# Altium schematic sheet k26_baseboard_connectors1.SchDoc: k26 Baseboard Connectors 1
size A3; DrawnBy: Ch. Vogt; Engineer: Ch. Vogt; Organization: PBL; DocumentNumber: 1; Revision: r5; SheetNumber: 2
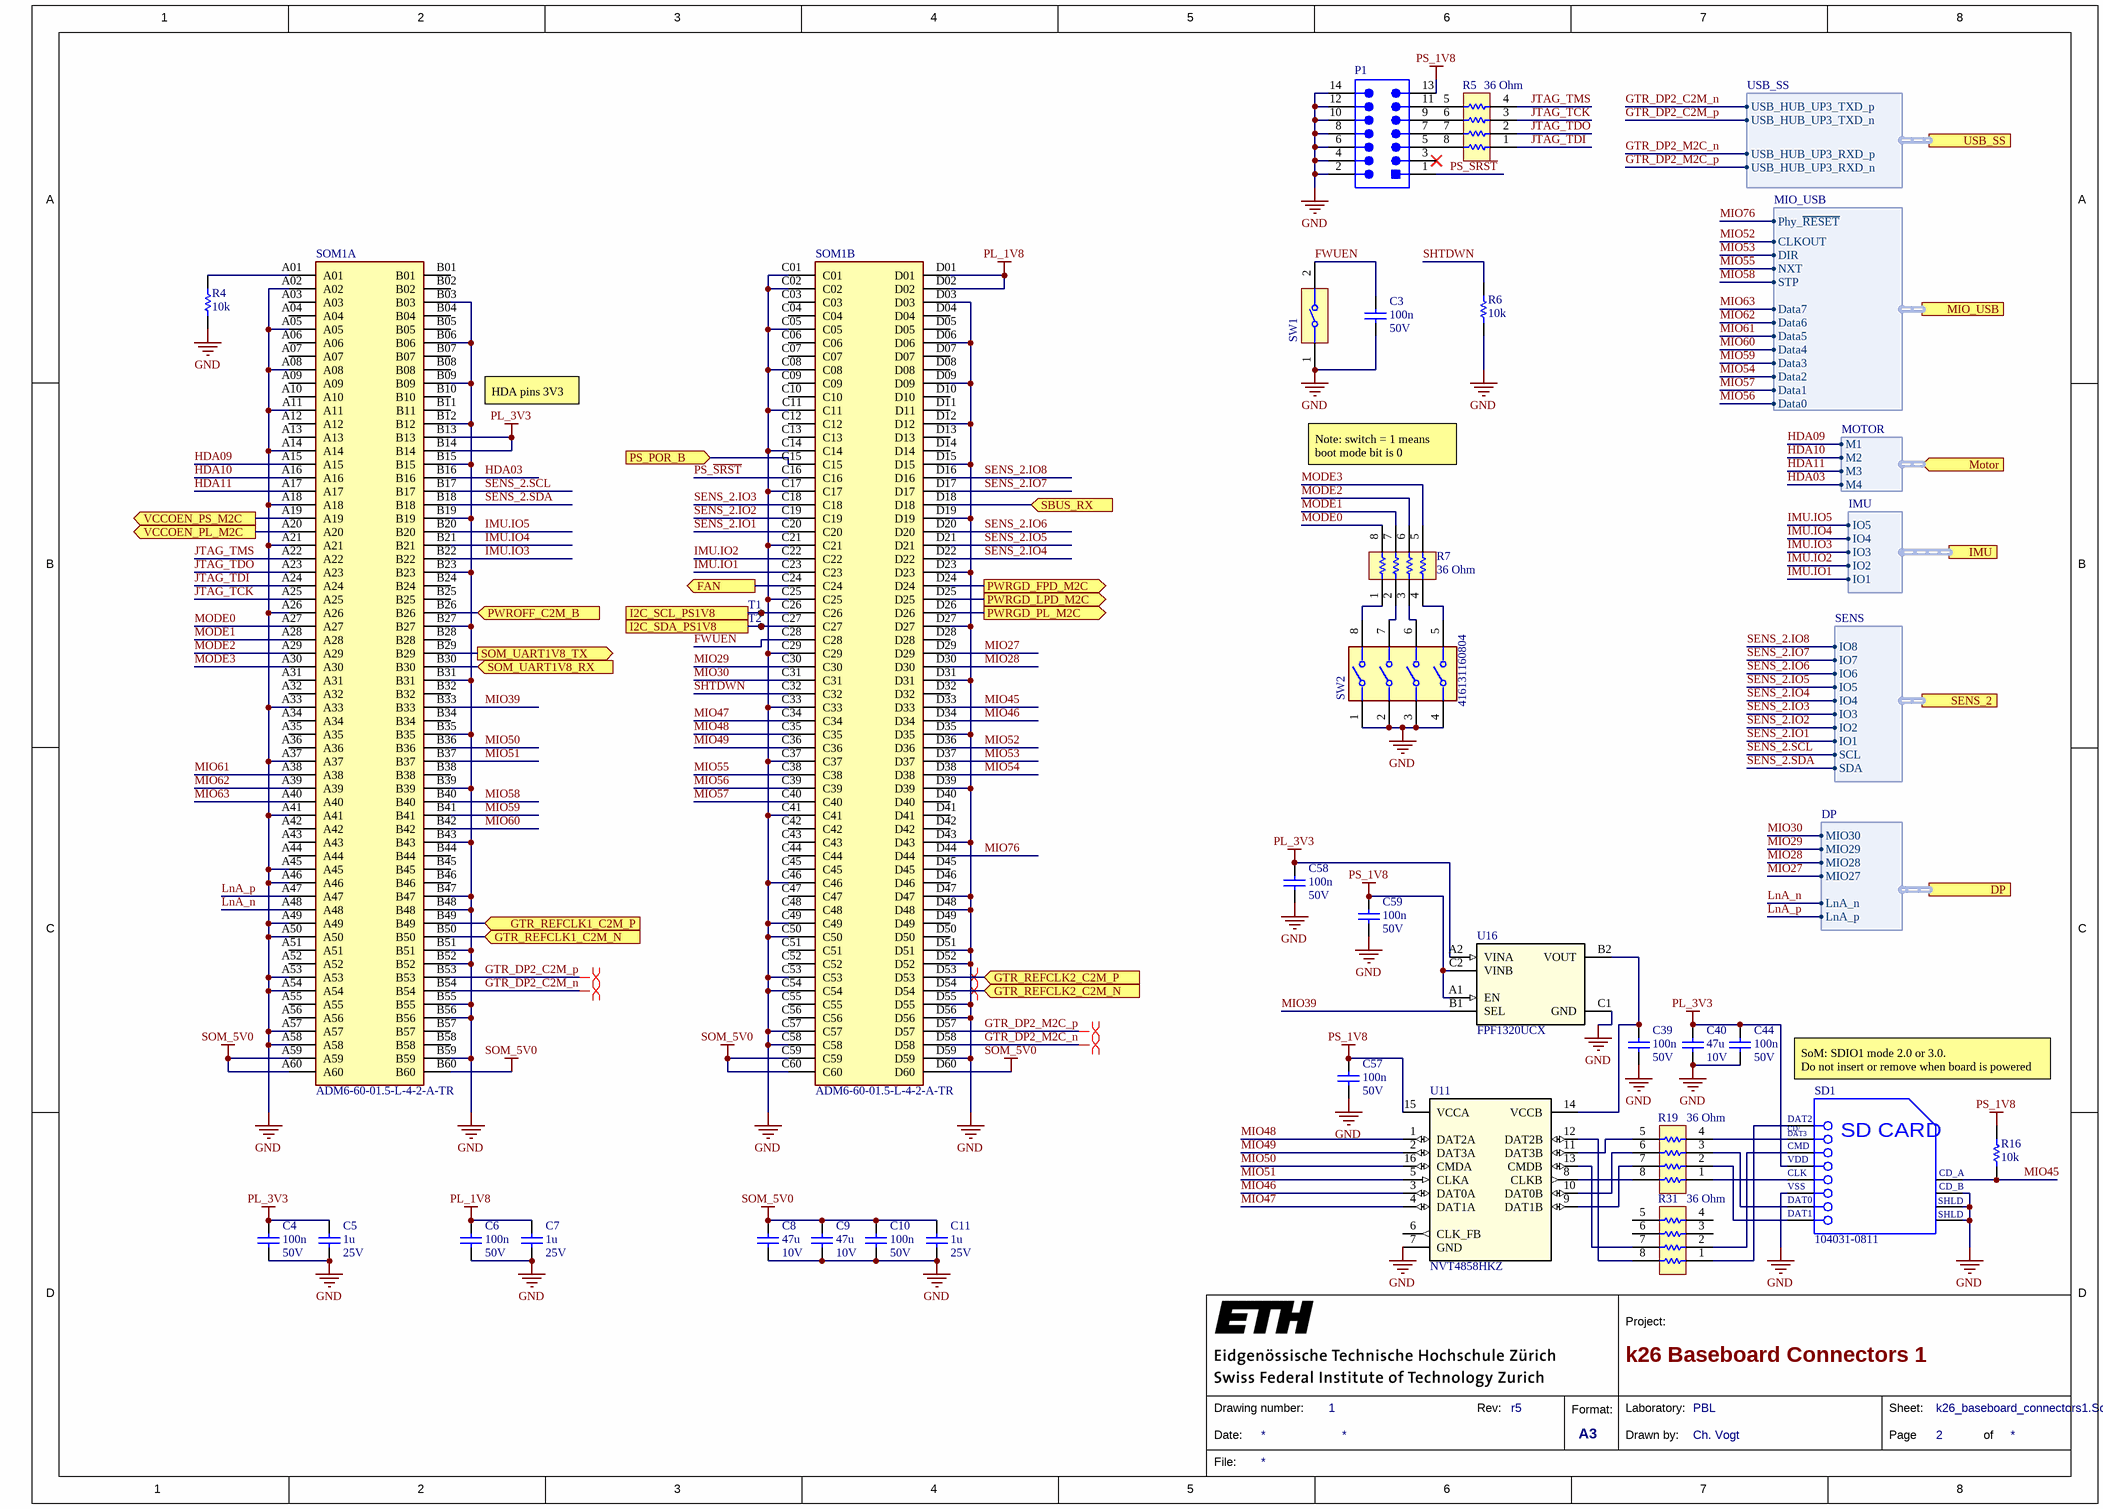
[diagram p0: k26_baseboard_connectors1.SchDoc]

## Parts
C3  100n  Rated DC Voltage (URdc): 50V  [CAPC0402]
C4  100n  Rated DC Voltage (URdc): 50V  [CAPC0402]
C5  1u  Rated DC Voltage (URdc): 25V  [CAPC0402]
C6  100n  Rated DC Voltage (URdc): 50V  [CAPC0402]
C7  1u  Rated DC Voltage (URdc): 25V  [CAPC0402]
C8  47u  Rated DC Voltage (URdc): 10V  [CAPC1206]
C9  47u  Rated DC Voltage (URdc): 10V  [CAPC1206]
C10  100n  Rated DC Voltage (URdc): 50V  [CAPC0402]
C11  1u  Rated DC Voltage (URdc): 25V  [CAPC0402]
C39  100n  Rated DC Voltage (URdc): 50V  [CAPC0402]
C40  47u  Rated DC Voltage (URdc): 10V  [CAPC1206]
C44  100n  Rated DC Voltage (URdc): 50V  [CAPC0402]
C57  100n  Rated DC Voltage (URdc): 50V  [CAPC0402]
C58  100n  Rated DC Voltage (URdc): 50V  [CAPC0402]
C59  100n  Rated DC Voltage (URdc): 50V  [CAPC0402]
P1  (no value)  [MOLX-87833-1420_V]
R4  10k  [RES0402]
R5  Resistance: 36 Ohm  [BOUR-CAY10-J4_V]  (hidden comment: CAY10-360J4LF)
R6  10k  [RES0402]
R7  Resistance: 36 Ohm  [BOUR-CAY10-J4_V]  (hidden comment: CAY10-360J4LF)
R16  10k  [RES0402]
R19  Resistance: 36 Ohm  [BOUR-CAY10-J4_V]  (hidden comment: CAY10-360J4LF)
R31  Resistance: 36 Ohm  [BOUR-CAY10-J4_V]  (hidden comment: CAY10-360J4LF)
SD1  104031-0811  [MOLX-104031-0811_V]
SOM1  ADM6-60-01.5-L-4-2-A-TR  [SAMTEC_ADM6-60-01.5-L-4-2-A-TR]  (parts A,B of 2)
SW1  KSS241GLFS  [KSS241GLFS]  (value not drawn)
SW2  416131160804  [FP-416131160804-MFG]
T1  (no value)  [Pad-1mm]  (no BOM)
T2  (no value)  [Pad-1mm]  (no BOM)
U11  NVT4858HKZ  [NVT4858_NXP]
U16  FPF1320UCX  [WLCSP6_1X1.5_ONS-M]

## Ports
DP (harness DP), FAN (out), GTR_REFCLK1_C2M_N (in), GTR_REFCLK1_C2M_P (in), GTR_REFCLK2_C2M_N (in), GTR_REFCLK2_C2M_P (in), I2C_SCL_PS1V8, I2C_SDA_PS1V8, IMU (harness IMU), MIO_USB (harness MIO_USB), Motor (in, harness MOTOR), PS_POR_B (in), PWRGD_FPD_M2C (out), PWRGD_LPD_M2C (out), PWRGD_PL_M2C (out), PWROFF_C2M_B (in), SBUS_RX (in), SENS_2 (harness SENS), SOM_UART1V8_RX (in), SOM_UART1V8_TX (out), USB_SS (harness USB_SS), VCCOEN_PL_M2C (out), VCCOEN_PS_M2C (out)

## Harnesses
MOTOR: M1, M2, M3, M4
MIO_USB: Data0, Data1, Data2, Data3, Data4, Data5, Data6, Data7, STP, NXT, DIR, CLKOUT, Phy_~{RESET}
DP: LnA_p, LnA_n, MIO27, MIO28, MIO29, MIO30
USB_SS: USB_HUB_UP3_RXD_n, USB_HUB_UP3_RXD_p, USB_HUB_UP3_TXD_n, USB_HUB_UP3_TXD_p
SENS: SCL, SDA, IO1, IO2, IO3, IO4, IO5, IO6, IO7, IO8
IMU: IO1, IO2, IO3, IO4, IO5

## Nets
GND: C3.1 C4.1 C5.1 C6.1 C7.1 C8.1 C9.1 C10.1 C11.1 C39.1 C40.1 C44.1 C57.1 C58.1 C59.1 P1.2 P1.4 P1.6 P1.8 P1.10 P1.12 P1.14 R4.1 R6.1 SD1.6(VSS2) SD1.10(CD_B) SD1.11(SHLD1) SD1.12(SHLD2) SOM1.A02 SOM1.A05 SOM1.A08 SOM1.A11 SOM1.A14 SOM1.A18 SOM1.A21 SOM1.A26 SOM1.A33 SOM1.A37 SOM1.A41 SOM1.A45 SOM1.A46 SOM1.A49 SOM1.A50 SOM1.A53 SOM1.A54 SOM1.A57 SOM1.A58 SOM1.B03 SOM1.B06 SOM1.B09 SOM1.B12 SOM1.B15 SOM1.B19 SOM1.B23 SOM1.B27 SOM1.B31 SOM1.B35 SOM1.B39 SOM1.B43 SOM1.B47 SOM1.B48 SOM1.B51 SOM1.B52 SOM1.B55 SOM1.B56 SOM1.B59 SOM1.C01 SOM1.C02 SOM1.C05 SOM1.C08 SOM1.C11 SOM1.C14 SOM1.C17 SOM1.C21 SOM1.C25 SOM1.C29 SOM1.C33 SOM1.C37 SOM1.C41 SOM1.C46 SOM1.C49 SOM1.C50 SOM1.C53 SOM1.C54 SOM1.C57 SOM1.C58 SOM1.D03 SOM1.D06 SOM1.D09 SOM1.D12 SOM1.D15 SOM1.D19 SOM1.D23 SOM1.D27 SOM1.D31 SOM1.D35 SOM1.D39 SOM1.D43 SOM1.D47 SOM1.D48 SOM1.D51 SOM1.D52 SOM1.D55 SOM1.D56 SOM1.D59 SW1.1(T1) SW2.1 SW2.2 SW2.3 SW2.4 U11.7(GND) U16.C1(GND)
PL_1V8: C6.2 C7.2 SOM1.D01 SOM1.D02
PL_3V3: C4.2 C5.2 C40.2 C44.2 C58.2 SD1.4(VDD) SOM1.B13 SOM1.B14 U16.A2(VINA)
PS_1V8: C57.2 C59.2 P1.13 R16.2 U11.15(VCCA) U16.A1(EN) U16.C2(VINB)
SOM_5V0: C8.2 C9.2 C10.2 C11.2 SOM1.A59 SOM1.A60 SOM1.B60 SOM1.C59 SOM1.C60 SOM1.D60
FAN: SOM1.C24 ; port FAN
FWUEN: C3.2 SOM1.C28 SW1.2(T2)
GTR_DP2_C2M_n: SOM1.B54 ; port USB_SS.USB_HUB_UP3_TXD_p
GTR_DP2_C2M_p: SOM1.B53 ; port USB_SS.USB_HUB_UP3_TXD_n
GTR_DP2_M2C_n: SOM1.D58 ; port USB_SS.USB_HUB_UP3_RXD_p
GTR_DP2_M2C_p: SOM1.D57 ; port USB_SS.USB_HUB_UP3_RXD_n
GTR_REFCLK1_C2M_N: SOM1.B50 ; port GTR_REFCLK1_C2M_N
GTR_REFCLK1_C2M_P: SOM1.B49 ; port GTR_REFCLK1_C2M_P
GTR_REFCLK2_C2M_N: SOM1.D54 ; port GTR_REFCLK2_C2M_N
GTR_REFCLK2_C2M_P: SOM1.D53 ; port GTR_REFCLK2_C2M_P
HDA03: SOM1.B16 ; port Motor.M4
HDA09: SOM1.A15 ; port Motor.M1
HDA10: SOM1.A16 ; port Motor.M2
HDA11: SOM1.A17 ; port Motor.M3
I2C_SCL_PS1V8: SOM1.C26 T1.1 ; port I2C_SCL_PS1V8
I2C_SDA_PS1V8: SOM1.C27 T2.1 ; port I2C_SDA_PS1V8
IMU.IO1: SOM1.C23 ; port IMU.IO1
IMU.IO2: SOM1.C22 ; port IMU.IO2
IMU.IO3: SOM1.B22 ; port IMU.IO3
IMU.IO4: SOM1.B21 ; port IMU.IO4
IMU.IO5: SOM1.B20 ; port IMU.IO5
JTAG_TCK: R5.3 SOM1.A25
JTAG_TDI: R5.1 SOM1.A24
JTAG_TDO: R5.2 SOM1.A23
JTAG_TMS: R5.4 SOM1.A22
LnA_n: SOM1.A48 ; port DP.LnA_n
LnA_p: SOM1.A47 ; port DP.LnA_p
MIO27: SOM1.D29 ; port DP.MIO27
MIO28: SOM1.D30 ; port DP.MIO28
MIO29: SOM1.C30 ; port DP.MIO29
MIO30: SOM1.C31 ; port DP.MIO30
MIO39: SOM1.B33 U16.B1(SEL)
MIO45: R16.1 SD1.9(CD_A) SOM1.D33
MIO46: SOM1.D34 U11.3(DAT0A)
MIO47: SOM1.C34 U11.4(DAT1A)
MIO48: SOM1.C35 U11.1(DAT2A)
MIO49: SOM1.C36 U11.2(DAT3A)
MIO50: SOM1.B36 U11.16(CMDA)
MIO51: SOM1.B37 U11.5(CLKA)
MIO52: SOM1.D36 ; port MIO_USB.CLKOUT
MIO53: SOM1.D37 ; port MIO_USB.DIR
MIO54: SOM1.D38 ; port MIO_USB.Data2
MIO55: SOM1.C38 ; port MIO_USB.NXT
MIO56: SOM1.C39 ; port MIO_USB.Data0
MIO57: SOM1.C40 ; port MIO_USB.Data1
MIO58: SOM1.B40 ; port MIO_USB.STP
MIO59: SOM1.B41 ; port MIO_USB.Data3
MIO60: SOM1.B42 ; port MIO_USB.Data4
MIO61: SOM1.A38 ; port MIO_USB.Data5
MIO62: SOM1.A39 ; port MIO_USB.Data6
MIO63: SOM1.A40 ; port MIO_USB.Data7
MIO76: SOM1.D44 ; port MIO_USB.Phy_~{RESET}
MODE0: R7.8 SOM1.A27
MODE1: R7.7 SOM1.A28
MODE2: R7.6 SOM1.A29
MODE3: R7.5 SOM1.A30
PS_POR_B: SOM1.C15 ; port PS_POR_B
PS_~{SRST}: P1.1 SOM1.C16
PWRGD_FPD_M2C: SOM1.D24 ; port PWRGD_FPD_M2C
PWRGD_LPD_M2C: SOM1.D25 ; port PWRGD_LPD_M2C
PWRGD_PL_M2C: SOM1.D26 ; port PWRGD_PL_M2C
PWROFF_C2M_B: SOM1.B26 ; port PWROFF_C2M_B
SBUS_RX: SOM1.D18 ; port SBUS_RX
SENS_2.IO1: SOM1.C20 ; port SENS_2.IO1
SENS_2.IO2: SOM1.C19 ; port SENS_2.IO2
SENS_2.IO3: SOM1.C18 ; port SENS_2.IO3
SENS_2.IO4: SOM1.D22 ; port SENS_2.IO4
SENS_2.IO5: SOM1.D21 ; port SENS_2.IO5
SENS_2.IO6: SOM1.D20 ; port SENS_2.IO6
SENS_2.IO7: SOM1.D17 ; port SENS_2.IO7
SENS_2.IO8: SOM1.D16 ; port SENS_2.IO8
SENS_2.SCL: SOM1.B17 ; port SENS_2.SCL
SENS_2.SDA: SOM1.B18 ; port SENS_2.SDA
SHTDWN: R6.2 SOM1.C32
SOM_UART1V8_RX: SOM1.B30 ; port SOM_UART1V8_RX
SOM_UART1V8_TX: SOM1.B29 ; port SOM_UART1V8_TX
VCCOEN_PL_M2C: SOM1.A20 ; port VCCOEN_PL_M2C
VCCOEN_PS_M2C: SOM1.A19 ; port VCCOEN_PS_M2C
NetC39_2: C39.2 U11.14(VCCB) U16.B2(VOUT)
NetP1_5: P1.5 R5.8
NetP1_7: P1.7 R5.7
NetP1_9: P1.9 R5.6
NetP1_11: P1.11 R5.5
NetR4_2: R4.2 SOM1.A01
NetR7_1: R7.1 SW2.8
NetR7_2: R7.2 SW2.7
NetR7_3: R7.3 SW2.6
NetR7_4: R7.4 SW2.5
NetR19_1: R19.1 SD1.5(CLK)
NetR19_2: R19.2 SD1.8(DAT1)
NetR19_3: R19.3 SD1.7(DAT0)
NetR19_4: R19.4 SD1.2(CMD)
NetR19_5: R19.5 U11.11(DAT3B)
NetR19_6: R19.6 U11.10(DAT0B)
NetR19_7: R19.7 U11.9(DAT1B)
NetR19_8: R19.8 U11.8(CLKB)
NetR31_1: R31.1 SD1.1(CD/DAT3)
NetR31_2: R31.2 SD1.3(VSS1)
NetR31_7: R31.7 U11.13(CMDB)
NetR31_8: R31.8 U11.12(DAT2B)

Not connected (* = marked no-connect by the designer): P1 3*; R31 3 4 5 6; SOM1 A03 A04 A06 A07 A09 A10 A12 A13 A31 A32 A34 A35 A36 A42 A43 A44 A51 A52 A55 A56 B01 B02 B04 B05 B07 B08 B10 B11 B24 B25 B28 B32 B34 B38 B44 B45 B46 B57 B58 C03 C04 C06 C07 C09 C10 C12 C13 C42 C43 C44 C45 C47 C48 C51 C52 C55 C56 D04 D05 D07 D08 D10 D11 D13 D14 D28 D32 D40 D41 D42 D45 D46 D49 D50; U11 6(CLK_FB)

## Layout directives
differential pair: GTR_DP2_C2M_n, GTR_DP2_C2M_p, GTR_DP2_M2C_n, GTR_DP2_M2C_p, GTR_REFCLK2_C2M_N, GTR_REFCLK2_C2M_P

## Notes on the sheet
- HDA pins 3V3
- Note: switch = 1 means boot mode bit is 0
- SoM: SDIO1 mode 2.0 or 3.0.
  Do not insert or remove when board is powered
- 1
- 2
- 3
- 4
- 5
- 6
- 7
- 8
- A
- B
- C
- D
- Project:
- Date:
- Drawing number:
- Rev:
- Format:
- A3
- Drawn by:
- Laboratory:
- Page
- Sheet:
- of
- File:
- (in symbol CMP-2000-05825-1) DAT2; CD/; DAT3; SD CARD; VSS; SHLD

## Library data of the parts
C3 C4 C6 C10 C39 C44 C57-C59 = cap0402: Ceramic Capacitor, Multilayer, Ceramic, 50V, 10% +Tol, 10% -Tol, X5R, 15% TC, 0.1uF, Surface Mount, 0402; Manufacturer: Yageo; Manufacturer Part Number: CC0402KRX5R9BB104; Capacitance: 100nF; Multilayer: Yes; Supplier 1: Farnell; Supplier Part Number 1: 3366442; RoHS: Yes; Category: Ceramic Capacitors; Stock 1: 180000; Pricing 1: 10000=0.00890, 50000=0.00870 (CHF); Mount: Surface Mount; Number of Pins: 2; Dielectric Material: Ceramic; Package Shape: Rectangular; Size Code: 0402; Terminal Finish: Nickel; Min Operating Temperature: -55°C; Max Operating Temperature: 85°C; JESD-609 Code: e3; Capacitor Type: Ceramic; Negative Tolerance: 10%; Temperature Characteristics Code: X5R; Termination: Wraparound; Positive Tolerance: 10%; Package Style: SMTMeter; Packaging: Tape and Reel; Length: 1mm; Width: 0.5mm; Height: 0.5mm; Reach SVHC Compliant: Yes; RoHS Compliant: Yes; ComponentLink1URL: https://datasheet.ciiva.com:443/pdfs/VipMasterIC/IC/YAGO/YAGO-S-A0006851646/YAGO-S-A0006851646-1.pdf?src-supplier=IHS+Markit; ComponentLink1Description: https://datasheet.ciiva.com:443/pdfs/VipMasterIC/IC/YAGO/YAGO-S-A0006851646/YAGO-S-A0006851646-1.pdf?src-supplier=IHS+Markit; ComponentLink2URL: http://www.yageo.com/documents/recent/UPY-GPHC_X5R_4V-to-50V_25.pdf?src-supplier=Digi-Key; ComponentLink2Description: http://www.yageo.com/documents/recent/UPY-GPHC_X5R_4V-to-50V_25.pdf?src-supplier=Digi-Key; ComponentLink3URL: http://www.yageo.com/documents/recent/UPY-GPHC_X5R_4V-to-50V_23.pdf?src-supplier=Digi-Key; ComponentLink3Description: http://www.yageo.com/documents/recent/UPY-GPHC_X5R_4V-to-50V_23.pdf?src-supplier=Digi-Key
C5 C7 C11 = cap0402: Ceramic Capacitor, Multilayer, Ceramic, 25V, 20% +Tol, 20% -Tol, X5R, 15% TC, 1uF, Surface Mount, 0402; Manufacturer: Taiyo Yuden; Manufacturer Part Number: TMK105BJ105MV-F; Multilayer: Yes; Supplier: Rs; Supplier Part Number: 1843748; RoHS: Yes; Category: Ceramic Capacitors; Stock: 2400; Pricing: 200=0.05600, 600=0.05000, 1000=0.03900 (CHF); Mounting Technology: Surface Mount; Pins: 2; Dielectric Material: Ceramic; Case/Package: 0402; Package Shape: Rectangular; Terminal Finish: Nickel; Min Operating Temperature: -55°C; Max Operating Temperature: 85°C; Value: 1uF; Capacitor Type: Ceramic; Tolerance  (fill in as +-): 20%; Packaging: Tape and Reel; Tolerance (fill in as +-): 20%; Temperature Characteristics Code: X5R; Termination: Wraparound; Package Style: SMTMeter; JESD-609 Code: e3; Length: 1mm; Width: 0.5mm; Height: 0.5mm; Reach SVHC Compliant: Yes; RoHS Compliant: Yes; ComponentLink1URL: https://datasheet.ciiva.com:443/pdfs/VipMasterIC/IC/TAIY/TAIY-S-A0009103435/TAIY-S-A0009102669-1.pdf?src-supplier=IHS+Markit; ComponentLink1Description: https://datasheet.ciiva.com:443/pdfs/VipMasterIC/IC/TAIY/TAIY-S-A0009103435/TAIY-S-A0009102669-1.pdf?src-supplier=IHS+Markit; ComponentLink2URL: https://datasheet.ciiva.com/11596/tmk105bj105mv-f-ss-11596466.pdf?src-supplier=Avnet; ComponentLink2Description: https://datasheet.ciiva.com/11596/tmk105bj105mv-f-ss-11596466.pdf?src-supplier=Avnet; ComponentLink3URL: https://datasheet.ciiva.com/30154/128tmk105bj105mv-f-30154639.pdf?src-supplier=Onlinecomponents.com; ComponentLink3Description: https://datasheet.ciiva.com/30154/128tmk105bj105mv-f-30154639.pdf?src-supplier=Onlinecomponents.com; ComponentLink4URL: https://datasheet.ciiva.com/15922/tmk105bj105mv-f-pdf-15922317.pdf?src-supplier=Onlinecomponents.com; ComponentLink4Description: https://datasheet.ciiva.com/15922/tmk105bj105mv-f-pdf-15922317.pdf?src-supplier=Onlinecomponents.com; ComponentLink5URL: https://datasheet.ciiva.com/13404/mlcc-all-e-541559-13404206.pdf?src-supplier=Mouser; ComponentLink5Description: https://datasheet.ciiva.com/13404/mlcc-all-e-541559-13404206.pdf?src-supplier=Mouser
C8 C9 C40 = cap1206: Ceramic Capacitor, Multilayer, Ceramic, 10V, 20% +Tol, 20% -Tol, X5R, 15% TC, 47uF, Surface Mount, 1206; Manufacturer: KEMET; Manufacturer Part Number: C1206C476M8PACTU; Multilayer: Yes; Supplier 1: Farnell; Supplier Part Number 1: 2665744; RoHS: Yes; Category: Ceramic Capacitors; Stock 1: 34000; Pricing 1: 2000=0.49500, 10000=0.46500 (CHF); Mount: Surface Mount; Number of Pins: 2; Dielectric Material: Ceramic; Size Code: 1206; Package Shape: Rectangular; Terminal Finish: Nickel; Min Operating Temperature: -55°C; Max Operating Temperature: 85°C; Capacitance: 47uF; Capacitor Type: Ceramic; Negative Tolerance: 20%; Packaging: Tape and Reel; Positive Tolerance: 20%; Termination: Wraparound; JESD-609 Code: e3; Package Style: SMTMeter; Temperature Characteristics Code: X5R; Length: 3.2mm; Width: 1.6mm; Height: 1.6mm; RoHS Compliant: Yes; Reach SVHC Compliant: Yes; ComponentLink1URL: https://datasheet.ciiva.com:443/pdfs/VipMasterIC/IC/KEME/KEME-S-A0008991665/KEME-S-A0008991665-1.pdf?src-supplier=IHS+Markit; ComponentLink1Description: https://datasheet.ciiva.com:443/pdfs/VipMasterIC/IC/KEME/KEME-S-A0008991665/KEME-S-A0008991665-1.pdf?src-supplier=IHS+Markit; ComponentLink2URL: https://datasheet.ciiva.com/28608/1918694-28608743.pdf?src-supplier=Element14; ComponentLink2Description: https://datasheet.ciiva.com/28608/1918694-28608743.pdf?src-supplier=Element14; ComponentLink3URL: https://datasheet.ciiva.com/22705/1929483-22705482.pdf?src-supplier=Element14; ComponentLink3Description: https://datasheet.ciiva.com/22705/1929483-22705482.pdf?src-supplier=Element14
P1 = CMP-2000-05701-1: Male Header, Pitch 2 mm, 2 x 7 Position, Height 6.4 mm, -55 to 105 degC, RoHS, Rail/Tube; Mounting Angle: Right; Pitch: 2mm; Number of Positions / Contacts: 14; Brand: Molex; Current Rating: 2A; Voltage Rating: 125V; Mounting Technology: ThroughHole; Factory Pack Quantity: 3200; Product Category: Headers&WireHousings; Contact Plating: Gold; Contact Material: Brass; Package Reference: 87833-1420; Product Type: Headers; Number of Rows: 2; Series: 87833; Packaging: Tube; Housing Material: Thermoplastic; Type: Shrouded; Datasheet URL: http://www.molex.com/pdm_docs/sd/878331420_sd.pdf; Manufacturer URL: http://www.molex.com/; Termination Style: ThroughHole; Tradename: Milli-Grid; RoHS: Details; Package Description: 14-Pin Through Hole Device, Body 16.65 x 6.3 mm, Pitch 2 mm; Manufacturer: Molex; Number of Positions: 14; Mounting Style: ThroughHole; Datasheet Version: Rev. G, 01/2012
R4 R6 R16 = res0402: Fixed Resistor, Metal Glaze/thick Film, 0.1W, 10000ohm, 50V, 1% +/-Tol, 100ppm/Cel, Surface Mount, 0402; Manufacturer: Panasonic; Manufacturer Part Number: ERJ-2RKF1002X; Power: 100mW; Value: 10kR; Temperature Coefficient: 100ppm/°C; Rated Temperature: 70°C; Package Height: 0.35mm; Package Length: 1mm; Package Width: 0.5mm; Reference Standard: AEC-Q200; Supplier: Rs; Supplier Part Number: 7325246; RoHS: Yes; Category: Chip SMD Resistors; Pricing: 10000=0.00600, 30000=0.00500 (CHF); Mounting Technology: Surface Mount; Pins: 2; Case/Package: 0402; Terminal Finish: Nickel; Package Shape: Rectangular; Min Operating Temperature: -55°C; Max Operating Temperature: 155°C; Tolerance: 1%; Resistor Type: FIXED RESISTOR; Technology: METAL GLAZE/THICK FILM; Termination: Wraparound; Working Voltage: 50V; Construction: Rectangular; Package Style: SMTMeter; Packaging: Tape and Reel; JESD-609 Code: e3; Reach SVHC Compliant: Yes; RoHS Compliant: Yes; ComponentLink1URL: https://datasheet.ciiva.com:443/pdfs/VipMasterIC/IC/PANA/PANA-S-A0009889626/PANA-S-A0009889626-1.pdf?src-supplier=IHS+Markit; ComponentLink1Description: https://datasheet.ciiva.com:443/pdfs/VipMasterIC/IC/PANA/PANA-S-A0009889626/PANA-S-A0009889626-1.pdf?src-supplier=IHS+Markit
  R4: Stock: 1630000
  R6 R16: Stock: 250000
R5 R7 R19 R31 = CMP-1734-00001-1: Chip Resistor Array, 36 Ohm, +/- 5%, 62.5 mW, -55 to 125 degC, 8-Pin SMD, RoHS, Tape and Reel; Power Rating: 120 mW; Type (Resistor): Thick Film; ComponentLink1URL: http://www.bourns.com/; ComponentLink2Description: Datasheet; Height: 0.018 inch; Mounting Technology: Surface Mount; ComponentLink2URL: http://www.bourns.com/docs/Product-Datasheets/CAY10.pdf; PartNumber: CAY10-360J4LF; Case Code (Metric): 2010; ComponentLink1Description: Manufacturer URL; DatasheetVersion: 01/2015; Width: 0.039 inch; Packaging: Tape and Reel; Pins: 8; RoHSCompliant: true; Mount: Surface Mount; Package Quantity: 10000; Length: 0.079 inch; PackageDescription: 8-Pin Surface Mount Device, Body 2 x 1 mm, Pitch 0.5 mm; Max Operating Temperature: 125 degC; Min Operating Temperature: -55 degC; Case/Package: 0804; Tolerance: 5%
SD1 = CMP-2000-05825-1: Micro SD Card, RA, -25 to 85 degC, 8-Pin SMD, RoHS, Tape and Reel; Manufacturer Part Number: 1040310811; Voltage Rating: 10VAC/DC; Number of Contacts: 8; Insertion - Extraction Style: Push-Pull; Pitch: 1.1mm; Mating Cycles: 10000; Brand: Molex; Current Rating: 500mA; Manufacturer URL: http://www.molex.com/; Card Type: microSD; Mounting Type: Standard; Height: 1.42mm; Mounting Technology: SurfaceMount; Contact Plating: Gold; Product Category: MemoryCardConnectors; Package Description: 8-Pin Surface Mount Device, Body 11.95 x 11.4 mm, Pitch 1.1 mm; Datasheet URL: http://www.molex.com/pdm_docs/sd/1040310811_sd.pdf; Termination Style: SMD; Length: 11.4mm; Housing Material: LiquidCrystalPolymer(LCP); Orientation: RightAngle; RoHS: True; Contact Material: PhosphorBronze; Datasheet Version: Rev. E, 04/2006; Packaging: Reel; Manufacturer: Molex; Series: 104031; Product: CardConnectors; Number of Rows: 1Row; Package Reference: 104031-0811
SOM1 = ADM6-60-01.5-L-4-2-A-TR: 0.635 mm AcceleRate HD High-Density 4-Row Header; Package: None; Price: None; Value: *; MP: ADM6-60-01.5-L-4-2-A-TR; Availability: Unavailable
SW1 = CMP-00077-3: SWITCH TACTILE SPST-NO 0.05A 50V; Manufacturer: ITT C&K; Illumination: Non-Illuminated; Operating Force: 400gf; Switch Travel: 0.30mm; Outline: 7.00mm x 3.50mm; Ingress Protection: IP40; Switch Function: Off-Mom; Contact Rating @ Voltage: 0.05A @ 50VDC; Mechanical Life: 100,000 Cycles; Actuator Type: Rectangular Button; Actuator Orientation: Side Actuated; Illumination Type, Color: -; Features: Tactile Feedback; Circuit: SPST-NO; Supplier: Digi-Key; Supplier Part Number: 401-1099-2-ND; P/N: KSS241GLFS; Mounting Type: Surface Mount, Right Angle; Illumination Voltage (Nominal): -; ComponentLink1URL: http://www.ck-components.com/14403/kss.pdf/; Termination Style: Gull Wing; Actuator Material: -; Actuator Height off PCB, from Pins: -; Packaging: Tape & Reel (TR); Operating Temperature: -40°C ~ 85°C; Manufacturer Part Number: KSS241GLFS
SW2 = CMP-1433-00004-2: SWITCH SLIDE DIP SPST 25MA 24V; Body Material: Polyphenylene; Washable: Yes; Actuator Type: Slide (Standard); Number of Positions: 4; Contact Resistance: 50mR; Electrical Life: 1000Cycles; Mechanical Life: 2000Cycles; Insulation Resistance: 100MR; Pitch: 0.05inch; Max Operating Temperature: 85°C; Min Operating Temperature: -40°C; Series: WS-DISV; Contact Material: Copper Alloy; RoHS Compliant: Yes; Throw Configuration: SPST; Max Voltage Rating (DC): 24V; Height: 2mm; Voltage Rating (DC): 24V; Contact Plating: Gold; Current Rating: 25mA; Lead Free: Lead Free; Width: 5.6mm; Termination: Gull Wing; Mount: Surface Mount; REACH SVHC: No SVHC; Contact Current Rating: 25mA; Package Quantity: 1; Packaging: Cut Tape; Length: 0.241inch; Number of Circuits: 4
T1 T2 = CMP-01283-1: 1mm SMT Test Pad; Mounting Technology: SMT
U11 = NVT4858HKZ: No Description Available; Mfr_Name: NXP; RefDes: RefDes; Type: Type
U16 = FPF1320UCX: No Description Available; Mfr_Name: onsemi; RefDes: RefDes; Type: Type